# EAGLE design IP_show (EAGLE 9.2.2)
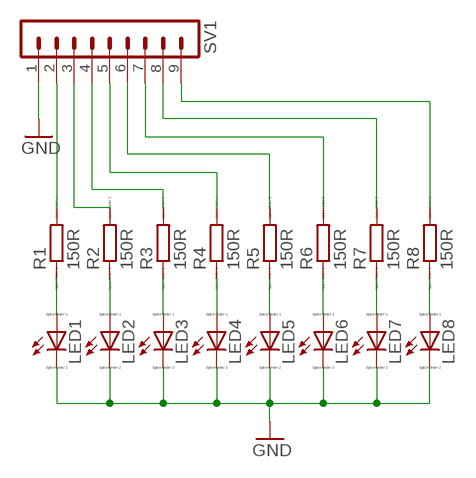
[diagram p0: schematic, sheet 1]

## Parts
LED1  LED_E  [LED_1206]
LED2  LED_E  [LED_1206]
LED3  LED_E  [LED_1206]
LED4  LED_E  [LED_1206]
LED5  LED_E  [LED_1206]
LED6  LED_E  [LED_1206]
LED7  LED_E  [LED_1206]
LED8  LED_E  [LED_1206]
R1  150R  RR1206  [R1206]
R2  150R  RR1206  [R1206]
R3  150R  RR1206  [R1206]
R4  150R  RR1206  [R1206]
R5  150R  RR1206  [R1206]
R6  150R  RR1206  [R1206]
R7  150R  RR1206  [R1206]
R8  150R  RR1206  [R1206]
SV1  MA09-1  [MA09-1]

## Nets
GND: LED1.C LED2.C LED3.C LED4.C LED5.C LED6.C LED7.C LED8.C SV1.1
N$1: LED8.A R8.1
N$2: LED7.A R7.1
N$3: LED6.A R6.1
N$4: LED5.A R5.1
N$5: LED4.A R4.1
N$6: LED3.A R3.1
N$7: LED2.A R2.1
N$8: LED1.A R1.1
N$9: R8.2 SV1.9
N$10: R7.2 SV1.8
N$11: R6.2 SV1.7
N$12: R5.2 SV1.6
N$13: R4.2 SV1.5
N$14: R3.2 SV1.4
N$15: R2.2 SV1.3
N$16: R1.2 SV1.2

## Library data of the parts
LED1-LED8 = eagle-ltspice:LED_E: LED Source: http://www.osram.convergy.de Source: www.luxeon.com Source: www.kingbright.com; SPICEMODEL: NONE; SPICEPREFIX: D; SPICETYPE: diode
R1-R8 = eagle-ltspice:R: RESISTOR, European symbol; SPICEMODEL: NONE; SPICEPREFIX: R
SV1 = con-lstb:MA09-1: PIN HEADER; OC_FARNELL: unknown; OC_NEWARK: unknown

## Board
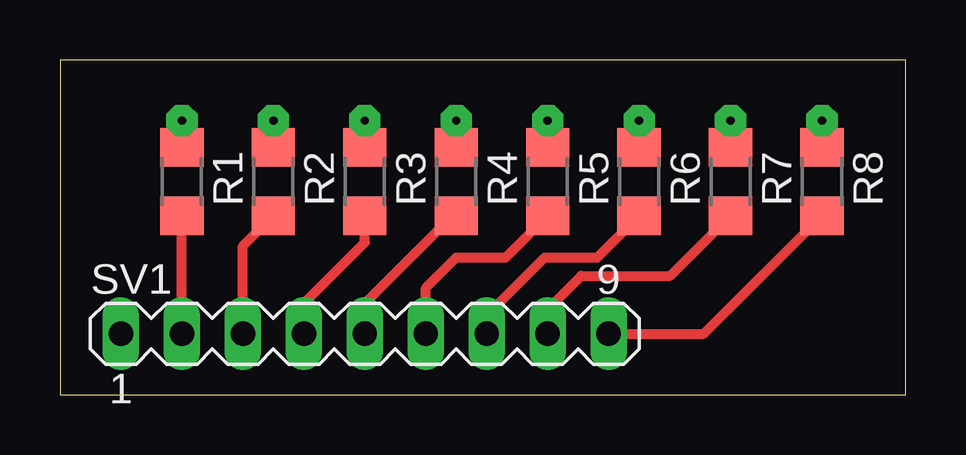
[diagram p1: board, top side]
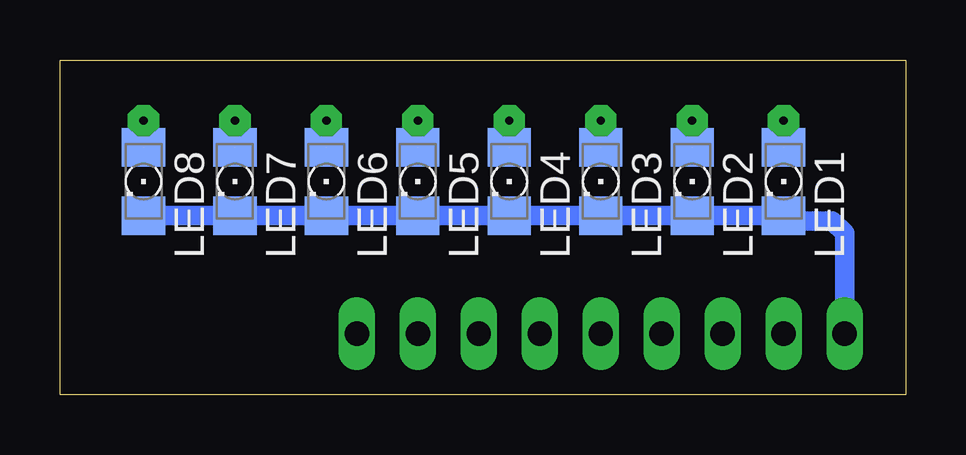
[diagram p2: board, bottom side, seen from below]

Size 35.23 x 13.96 mm. Coordinates in mm from the lower left corner, seen from the top.
Outline: 0,0 35.23,0 35.23,13.96 0,13.96 0,0
Copper layers (1*16): Top 0.035mm / dielectric 1.5mm / Bottom 0.035mm
Design rules "default": minimum track width 6mil, minimum drill 0.35mm, track to track 6mil, track to pad 6mil, pad to pad 6mil, via to via 6mil, smd to smd 6mil, copper to edge 40mil, drill to drill 6mil, minimum pad ring 10mil, minimum via ring 8mil, stop-mask expansion 4mil, vias tented up to drill 0mil, thermal gap 10mil

### Footprints (pad centres in the part's own frame; a part is rotated, then mirrored left to right if it is on the bottom)
LED_1206 = smd 1.6 x 1.803: A -1.422,0; C 1.422,0
R1206 = smd 1.6 x 1.803: 1 -1.422,0; 2 1.422,0
MA09-1 = drill 1.016 long: 1 -10.16,0; 2 -7.62,0; 3 -5.08,0; 4 -2.54,0; 5 0,0; 6 2.54,0; 7 5.08,0; 8 7.62,0; 9 10.16,0

### Placement (x,y rotation side)
LED1  5.08,8.89 270 bottom
LED2  8.89,8.89 270 bottom
LED3  12.7,8.89 270 bottom
LED4  16.51,8.89 270 bottom
LED5  20.32,8.89 270 bottom
LED6  24.13,8.89 270 bottom
LED7  27.94,8.89 270 bottom
LED8  31.75,8.89 270 bottom
R1  5.08,8.89 270 top
R2  8.89,8.89 270 top
R3  12.7,8.89 270 top
R4  16.51,8.89 270 top
R5  20.32,8.89 270 top
R6  24.13,8.89 270 top
R7  27.94,8.89 270 top
R8  31.75,8.89 270 top
SV1  12.7,2.54 0 top

### Tracks (layer width: path | path; a pad name or v marks a point on that pad's centre or on a via)
GND
  Bottom 0.813: LED8.C LED7.C LED6.C LED5.C LED4.C LED3.C LED2.C LED1.C 4.85,7.24 3.05,7.24 2.54,6.73 SV1.1
N$1  (1 unrouted)
N$2  (1 unrouted)
N$3  (1 unrouted)
N$4  (1 unrouted)
N$5  (1 unrouted)
N$6  (1 unrouted)
N$7  (1 unrouted)
N$8  (1 unrouted)
N$9
  Top 0.406: SV1.9 26.82,2.54 R8.2
N$10
  Top 0.406: SV1.8 20.32,3.56 21.72,4.95 25.43,4.95 R7.2
N$11
  Top 0.406: SV1.7 17.78,3.3 20.19,5.71 22.38,5.71 R6.2
N$12
  Top 0.406: SV1.6 15.24,4.45 16.51,5.71 18.57,5.71 R5.2
N$13
  Top 0.406: SV1.5 12.7,3.81 16.36,7.47 R4.2
N$14
  Top 0.406: SV1.4 10.16,3.81 12.7,6.35 R3.2
N$15
  Top 0.406: R2.2 7.62,6.2 SV1.3
N$16
  Top 0.406: SV1.2 R1.2
N$17  (via drill 0.35 pad 1.3)
  other vias: 5.08,11.43
N$18  (via drill 0.35 pad 1.3)
  other vias: 8.89,11.43
N$19  (via drill 0.35 pad 1.3)
  other vias: 12.7,11.43
N$20  (via drill 0.35 pad 1.3)
  other vias: 16.51,11.43
N$21  (via drill 0.35 pad 1.3)
  other vias: 20.32,11.43
N$22  (via drill 0.35 pad 1.3)
  other vias: 24.13,11.43
N$23  (via drill 0.35 pad 1.3)
  other vias: 27.94,11.43
N$24  (via drill 0.35 pad 1.3)
  other vias: 31.75,11.43